# EasyEDA Pro project Jalousee PCB.eprj, schematic Jalousee PCB TC118S_1
Create Date: 2023-08-31; Page Name: P2; Project Name: Jalousee PCB; Schematic Name: Jalousee PCB TC118S_1; Update Date: 2023-09-17; Company: EasyEDA.com; Drawed: EasyEDA Pro; Page Size: A4; Part Number: JLCPCB-002; Reviewed: EasyEDA Pro; Version: V0.1
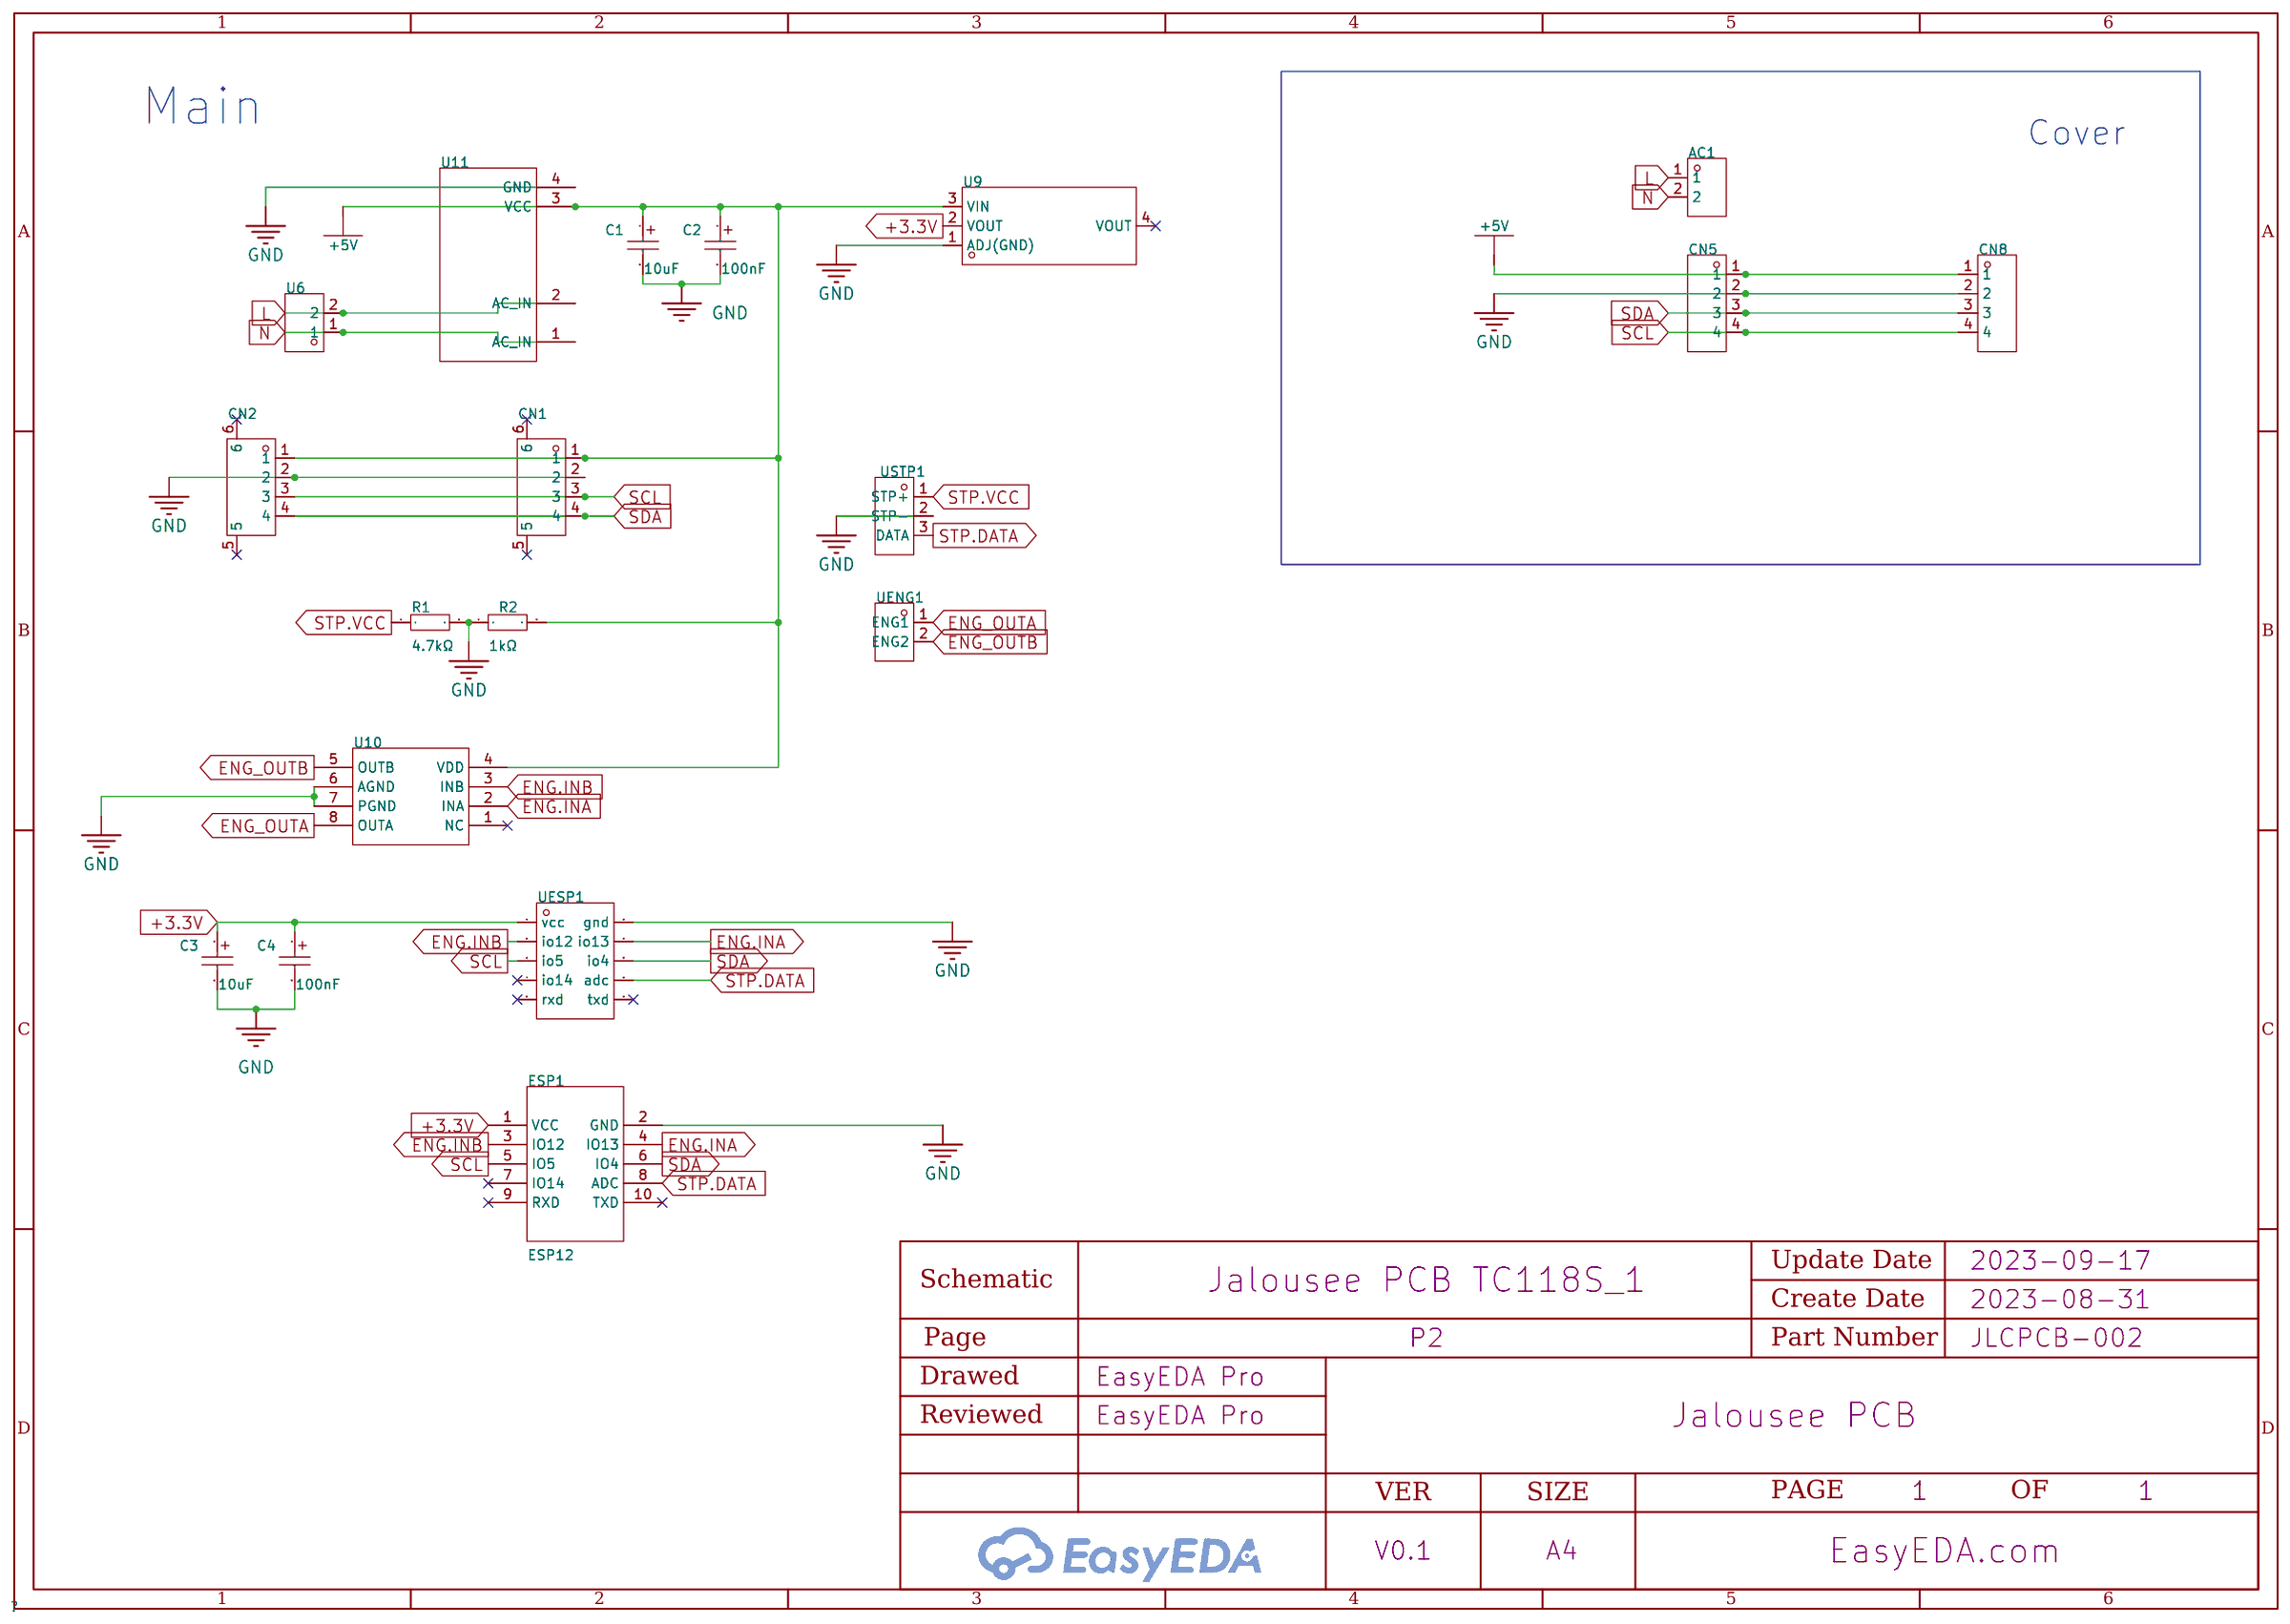
[diagram p3: schematic sheet]

## Parts
AC1  RT-C08-F2-WH  [AC-IN-TH_RT-C08-F2-WH]
C1  10uF  [CASE-A_3216]
C2  100nF  [CASE-A_3216]
C3  10uF  [CASE-A_3216]
C4  100nF  [CASE-A_3216]
CN1  HC-1.25-4PWT  [CONN-SMD_4P-P1.25-HC-1.25-4PWT]
CN2  HC-1.25-4PWT  [CONN-SMD_4P-P1.25-HC-1.25-4PWT]
CN5  HC-1.25-4AW  [CONN-TH_4P-P1.25_HCTL_HC-1.25-4AW]
CN8  HC-1.25-4A  [CONN-TH_4P-P1.25_HCTL_HC-1.25-4A]
ESP1  ESP12  [ESP12 10P]
R1  4.7kΩ  [R0603]
R2  1kΩ  [R0603]
U6  YC0220500000G  [CONN-TH_YC0220500000G]
U9  -  [SOT-223-3_L6.5-W3.4-P2.30-LS7.0-BR]
U10  -  [SOP-8_L4.9-W3.9-P1.27-LS6.0-BL]
U11  -  [ACDC Converter 5V, small]
UENG1  -  [CONN-TH_2P-P1.25_HCTL_HC-1.25-2A]
UESP1  -  [CONN-TH_10P-P2.54_DEALON_DW254R-22-10-85]
USTP1  -  [CONN-TH_3P-P1.25_HCTL_HC-1.25-3A]

## Library data of the parts
AC1 = RT-C08-F2-WH: Connector Type:AC电源插座 Mounting Style:Shrouded Operating Temperature Range:-10℃~+85℃ Operating Temperature Range:-10℃~+85℃; LCSC Part Name: 电源插座; Supplier Part: C7429381; Manufacturer: ROCKTEK(富力隆); Supplier Footprint: 插件; JLCPCB Part Class: Extended Part; Datasheet: https://atta.szlcsc.com/upload/public/pdf/source/20190702/C309250_1FE287713F45E58B06067927EDDEFE19.pdf; Supplier: LCSC; Connector Type: AC电源插座; Mounting Style: Shrouded; Operating Temperature Range: -10℃~+85℃
C1 C3 = TAJA106K010RNJ: Capacitance: Tolerance:±10% Tolerance:±10% Rated Voltage: Equivalent Series Resistance(ESR):3Ω@100kHz Operating Temperature:-55~+125 Operating Temperature:-55~+125; LCSC Part Name: 10uF ±10% 10V; Supplier Part: C7177; Manufacturer: Kyocera AVX; JLCPCB Part Class: Extended Part; Datasheet: https://atta.szlcsc.com/upload/public/pdf/source/20160107/1457707748330.pdf; Supplier: LCSC; Tolerance: ±10%; Equivalent Series Resistance(ESR): 3Ω@100kHz; Operating Temperature: -55~+125
C2 C4 = TAJA104K035RNJ: Capacitance: Tolerance:±10% Tolerance:±10% Rated Voltage: Equivalent Series Resistance(ESR):24Ω@100kHz Operating Temperature:-55~+125 Operating Temperature:-55~+125; LCSC Part Name: 100nF ±10% 35V; Supplier Part: C7173; Manufacturer: Kyocera AVX; JLCPCB Part Class: Extended Part; Datasheet: https://atta.szlcsc.com/upload/public/pdf/source/20160107/1457707748183.pdf; Supplier: LCSC; Tolerance: ±10%; Equivalent Series Resistance(ESR): 24Ω@100kHz; Operating Temperature: -55~+125
CN1 CN2 = HC-1.25-4PWT: Reference Series:- Pitch:1.25mm Pins Structure:1x4P Number of Rows:1 Number of PINs Per Row:4 Row Spacing:- Gender:公型插针 Mounting Style:Surface Mount Current Rating (Max):1A Operating Temperature Range:-25℃~+85℃ Operating Temperature Range:-25℃~+85℃; LCSC Part Name: 1.25mm 1x4P 卧贴; Supplier Part: C2845381; Manufacturer: HCTL(华灿天禄); Supplier Footprint: SMD,P=1.25mm; JLCPCB Part Class: Extended Part; Datasheet: https://atta.szlcsc.com/upload/public/pdf/source/20210728/C2845379_48B7DC28A4B35DB030A7253F7C3FD974.pdf; Supplier: LCSC; Pitch: 1.25mm; Pins Structure: 1x4P; Number of Rows: 1; Number of PINs Per Row: 4; Gender: 公型插针; Mounting Style: Surface Mount; Current Rating (Max): 1A; Operating Temperature Range: -25℃~+85℃
CN5 = HC-1.25-4AW: Reference Series:- Pitch:1.25mm Pins Structure:1x4P Number of Rows:1 Number of PINs Per Row:4 Row Spacing:- Gender:公型插针 Mounting Style:Shrouded Current Rating (Max):1A Operating Temperature Range:-25℃~+85℃ Operating Temperature Range:-25℃~+85℃; LCSC Part Name: 1.25mm 1x4P 弯插; Supplier Part: C2845537; Manufacturer: HCTL(华灿天禄); Supplier Footprint: 插件,P=1.25mm; JLCPCB Part Class: Extended Part; Datasheet: https://atta.szlcsc.com/upload/public/pdf/source/20210729/C2845535_17B4C65D5133EDBE0A07B8E05D9E3662.pdf; Supplier: LCSC; Pitch: 1.25mm; Pins Structure: 1x4P; Number of Rows: 1; Number of PINs Per Row: 4; Gender: 公型插针; Mounting Style: Shrouded; Current Rating (Max): 1A; Operating Temperature Range: -25℃~+85℃
CN8 = HC-1.25-4A: Reference Series:- Pitch:1.25mm Pins Structure:1x4P Number of Rows:1 Number of PINs Per Row:4 Row Spacing:- Gender:公型插针 Mounting Style:Straight Current Rating (Max):1A Operating Temperature Range:-25℃~+85℃ Operating Temperature Range:-25℃~+85℃; LCSC Part Name: 1.25mm 1x4P 直插; Supplier Part: C2845522; Manufacturer: HCTL(华灿天禄); Supplier Footprint: 插件,P=1.25mm; JLCPCB Part Class: Extended Part; Datasheet: https://atta.szlcsc.com/upload/public/pdf/source/20210729/C2845520_89EAA22C8D4DE2FB8A253230326912FB.pdf; Supplier: LCSC; Pitch: 1.25mm; Pins Structure: 1x4P; Number of Rows: 1; Number of PINs Per Row: 4; Gender: 公型插针; Mounting Style: Straight; Current Rating (Max): 1A; Operating Temperature Range: -25℃~+85℃
ESP1 = ESP12-10P-3.3V-MH
R1 = RC0603JR-074K7L: Overload Voltage (Max): Operating Temperature Range: Operating Temperature Range: Body Length:- Tolerance: φD:- Body Height:- Body Width:- Resistance: Type:Thick Film Resistors Temperature Coefficient: Temperature Coefficient: Power(Watts):; LCSC Part Name: 4.7kΩ ±5%; Supplier Part: C105428; Manufacturer: YAGEO(国巨); Supplier Footprint: 0603; JLCPCB Part Class: Extended Part; Datasheet: https://atta.szlcsc.com/upload/public/pdf/source/20170413/1492062713212.pdf; Supplier: LCSC; Type: Thick Film Resistors
R2 = RC0603FR-071KL: Type:Thick Film Resistors Resistance: Tolerance:±1% Tolerance:±1% Power(Watts): Temperature Coefficient:±100ppm/ Temperature Coefficient:±100ppm/ Overload Voltage (Max): Operating Temperature Range:-55~+155 Operating Temperature Range:-55~+155; LCSC Part Name: 1kΩ ±1% 100mW; Supplier Part: C22548; Manufacturer: YAGEO(国巨); Supplier Footprint: 0603; JLCPCB Part Class: Extended Part; Datasheet: https://atta.szlcsc.com/upload/public/pdf/source/20180312/7BD3618A8B6324EA6280B0497A051AB7.pdf; Supplier: LCSC; Type: Thick Film Resistors; Tolerance: ±1%; Temperature Coefficient: ±100ppm/; Operating Temperature Range: -55~+155
U6 = YC0220500000G: Pitch:5.08mm Number of Rows:1 Number of PINs Per Row:2 Mounting Style:直针 Current Rating (Max):10A Voltage Rating (Max):300V Wire Gauge - AWG:16~26 Wire Gauge - mm?:- Operating Temperature Range:-40℃~+115℃ Operating Temperature Range:-40℃~+115℃ Color:Green; LCSC Part Name: 5.08mm 排数:1 每排P数:2 直针; Supplier Part: C2683165; Manufacturer: Amphenol; Supplier Footprint: 直插,P=5.08mm; JLCPCB Part Class: Extended Part; Datasheet: https://atta.szlcsc.com/upload/public/pdf/source/20210329/C2683165_184F37C3428385EA6CBC65FCC2B0FE9A.pdf; Supplier: LCSC; Pitch: 5.08mm; Number of Rows: 1; Number of PINs Per Row: 2; Mounting Style: 直针; Current Rating (Max): 10A; Voltage Rating (Max): 300V; Wire Gauge - AWG: 16~26; Operating Temperature Range: -40℃~+115℃; Color: Green
U9 = AMS1117-3.3: Output Type:固定 Output Polarity:正 Number of Outputs:1 Maximum Input Voltage:18V Output Voltage:3.3V Output Voltage:3.3V Dropout Voltage:1.3V@(1A) Output Current:1A Power Supply Rejection Ratio (PSRR):60dB@(120Hz) Operating Temperature:±150@(Tj) Operating; LCSC Part Name: Vin=18V Vout=3.3V 1A 60dB@(120Hz); Supplier Part: C2891839; Manufacturer: YONGYUTAI(永裕泰); Supplier Footprint: SOT-223; JLCPCB Part Class: Extended Part; Datasheet: https://atta.szlcsc.com/upload/public/pdf/source/20210901/A75ADDE6A17DEE0002F2A58A8D1F3634.pdf; Supplier: LCSC; Output Type: 固定; Output Polarity: 正; Number of Outputs: 1; Maximum Input Voltage: 18V; Output Voltage: 3.3V; Dropout Voltage: 1.3V@(1A); Output Current: 1A; Power Supply Rejection Ratio (PSRR): 60dB@(120Hz); Operating Temperature: ±150@(Tj)
U10 = TC118S: Supplier Part: C88308; Manufacturer: FM富满; Supplier Footprint: SOP-8_150mil; JLCPCB Part Class: Extended Part; Datasheet: https://atta.szlcsc.com/upload/public/pdf/source/20161129/1480413782462.pdf; Supplier: LCSC
U11 = ACDC Converter (5v, 1A, small)
UENG1 = HC-1.25-2A: Reference Series:- Pitch:1.25mm Pins Structure:1x2P Number of Rows:1 Number of PINs Per Row:2 Row Spacing:- Gender:公型插针 Mounting Style:直插 Current Rating (Max):1A Operating Temperature Range:-25~+85 Operating Temperature Range:-25~+85; LCSC Part Name: 2P 间距P=1.25mm; Supplier Part: C2845520; Manufacturer: HCTL(华灿天禄); Supplier Footprint: 插件,P=1.25mm; JLCPCB Part Class: Extended Part; Datasheet: https://atta.szlcsc.com/upload/public/pdf/source/20210729/C2845520_89EAA22C8D4DE2FB8A253230326912FB.pdf; Supplier: LCSC; Pitch: 1.25mm; Pins Structure: 1x2P; Number of Rows: 1; Number of PINs Per Row: 2; Gender: 公型插针; Mounting Style: 直插; Current Rating (Max): 1A; Operating Temperature Range: -25~+85
UESP1 = DW254R-22-10-85: Pitch:2.54mm Number of Holes:10 Number of Rows:2 Holes Structure:2x5P Row Spacing:2.54mm Mounting Type:直插 Circular Hole / Square Hole:方孔 Current Rating (Max):3A Voltage Rating (Max):- Holes Direction:顶部 Insulation Height:8.5mm Operating Temperature Range:; LCSC Part Name: 2.54mm 2x5P; Supplier Part: C2935985; Manufacturer: DEALON(德艺隆); Supplier Footprint: 直插,P=2.54mm; JLCPCB Part Class: Extended Part; Datasheet: https://atta.szlcsc.com/upload/public/pdf/source/20211231/BFA45F732C9356EE88FA0C9F09D83196.pdf; Supplier: LCSC; Pitch: 2.54mm; Number of Holes: 10; Number of Rows: 2; Holes Structure: 2x5P; Row Spacing: 2.54mm; Mounting Type: 直插; Circular Hole / Square Hole: 方孔; Current Rating (Max): 3A; Holes Direction: 顶部; Insulation Height: 8.5mm
USTP1 = HC-1.25-3A: Reference Series:- Pitch:1.25mm Pins Structure:1x3P Number of Rows:1 Number of PINs Per Row:3 Row Spacing:- Gender:公型插针 Mounting Style:直插 Current Rating (Max):1A Operating Temperature Range:-25~+85 Operating Temperature Range:-25~+85; LCSC Part Name: 3P 间距P=1.25mm; Supplier Part: C2845521; Manufacturer: HCTL(华灿天禄); Supplier Footprint: 插件,P=1.25mm; JLCPCB Part Class: Extended Part; Datasheet: https://atta.szlcsc.com/upload/public/pdf/source/20210729/C2845520_89EAA22C8D4DE2FB8A253230326912FB.pdf; Supplier: LCSC; Pitch: 1.25mm; Pins Structure: 1x3P; Number of Rows: 1; Number of PINs Per Row: 3; Gender: 公型插针; Mounting Style: 直插; Current Rating (Max): 1A; Operating Temperature Range: -25~+85

## Nets
+3.3V: C3.1 C4.1 ESP1.1(VCC) U9.2(VOUT) UESP1.1(vcc)
+5V: C1.1 C2.1 CN1.1 CN2.1 CN5.1 CN8.1 R2.2 U9.3(VIN) U10.4(VDD) U11.3(VCC)
GND: C1.2 C2.2 C3.2 C4.2 CN1.2 CN2.2 CN5.2 CN8.2 ESP1.2(GND) R1.2 R2.1 U9.1(ADJ(GND)) U10.6(AGND) U10.7(PGND) U11.4(GND) UESP1.2(gnd) USTP1.2(STP-)
ENG.INA: ESP1.4(IO13) U10.2(INA) UESP1.4(io13)
ENG.INB: ESP1.3(IO12) U10.3(INB) UESP1.3(io12)
ENG_OUTA: U10.8(OUTA) UENG1.1(ENG1)
ENG_OUTB: U10.5(OUTB) UENG1.2(ENG2)
L: AC1.1 U6.2 U11.2(AC IN)
N: AC1.2 U6.1 U11.1(AC IN)
SCL: CN1.3 CN2.3 CN5.4 CN8.4 ESP1.5(IO5) UESP1.5(io5)
SDA: CN1.4 CN2.4 CN5.3 CN8.3 ESP1.6(IO4) UESP1.6(io4)
STP.DATA: ESP1.8(ADC) UESP1.8(adc) USTP1.3(DATA)
STP.VCC: R1.1 USTP1.1(STP+)

Not connected (* = marked no-connect by the designer): CN1 5* 6*; CN2 5* 6*; ESP1 7(IO14)* 9(RXD)* 10(TXD)*; U9 4(VOUT)*; U10 1(NC)*; UESP1 7(io14)* 9(rxd)* 10(txd)*

## Notes on the sheet
- Main
- Cover
